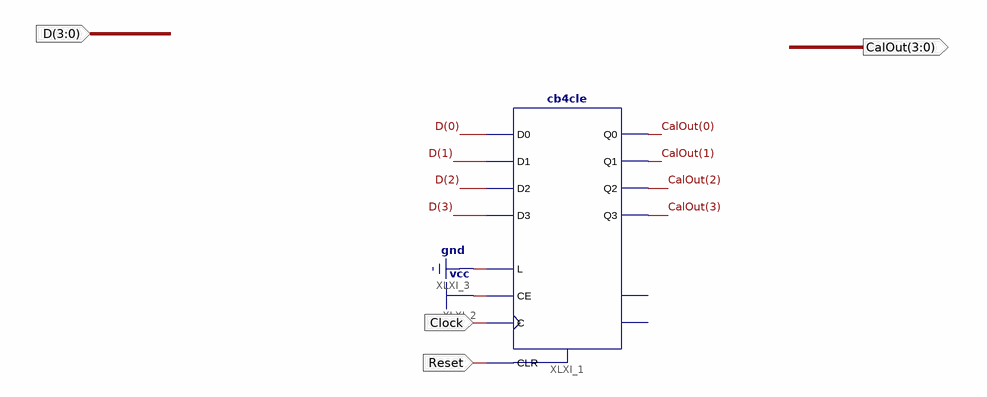
[diagram p0: schematic sheet 1]
// Xilinx ISE schematic dwe.sch (spartan3) as structural Verilog: 1 symbols, 4 ports
module dwe (
  input  [3:0] D,
  input  Clock,
  input  Reset,
  output [3:0] CalOut
);

  cb4cle XLXI_1 (
    .C(Clock), .CE(1'b1), .CLR(Reset), .D0(D[0]), .D1(D[1]), .D2(D[2]), .D3(D[3]), .L(1'b0), .Q0(CalOut[0]),
    .Q1(CalOut[1]), .Q2(CalOut[2]), .Q3(CalOut[3]));  // open: CEO, TC
endmodule
